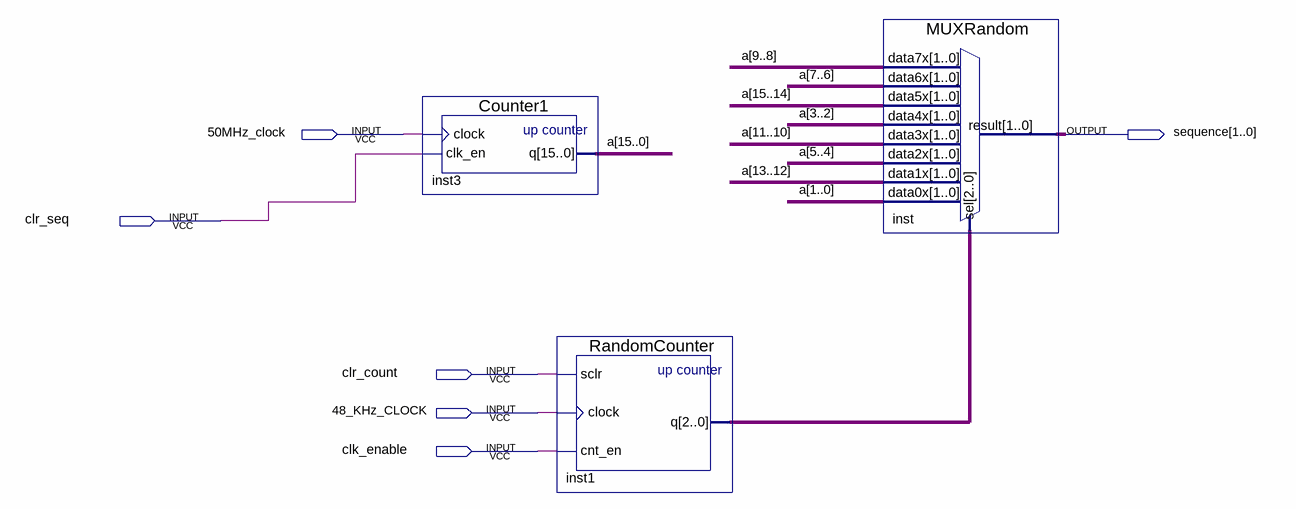
[diagram p0: schematic sheet]
// Quartus schematic RandomNumberGenerator.bdf as structural Verilog: 3 symbols, 6 pins
module RandomNumberGenerator (
  input  \50MHz_clock ,
  input  clr_seq,
  input  clr_count,
  input  \48_KHz_CLOCK ,
  input  clk_enable,
  output [1:0] \sequence 
);

  wire [2:0] inst1_q;
  wire [15:0] a;

  Counter1 inst3 (.clock(\50MHz_clock ), .clk_en(clr_seq), .q(a));
  RandomCounter inst1 (.sclr(clr_count), .clock(\48_KHz_CLOCK ), .cnt_en(clk_enable), .q(inst1_q));
  MUXRandom inst (
    .data7x(a[9:8]), .data6x(a[7:6]), .data5x(a[15:14]), .data4x(a[3:2]), .data3x(a[11:10]), .data2x(a[5:4]),
    .data1x(a[13:12]), .data0x(a[1:0]), .sel(inst1_q), .result(\sequence ));
endmodule
